# EAGLE design furby_osi (EAGLE 6.3)
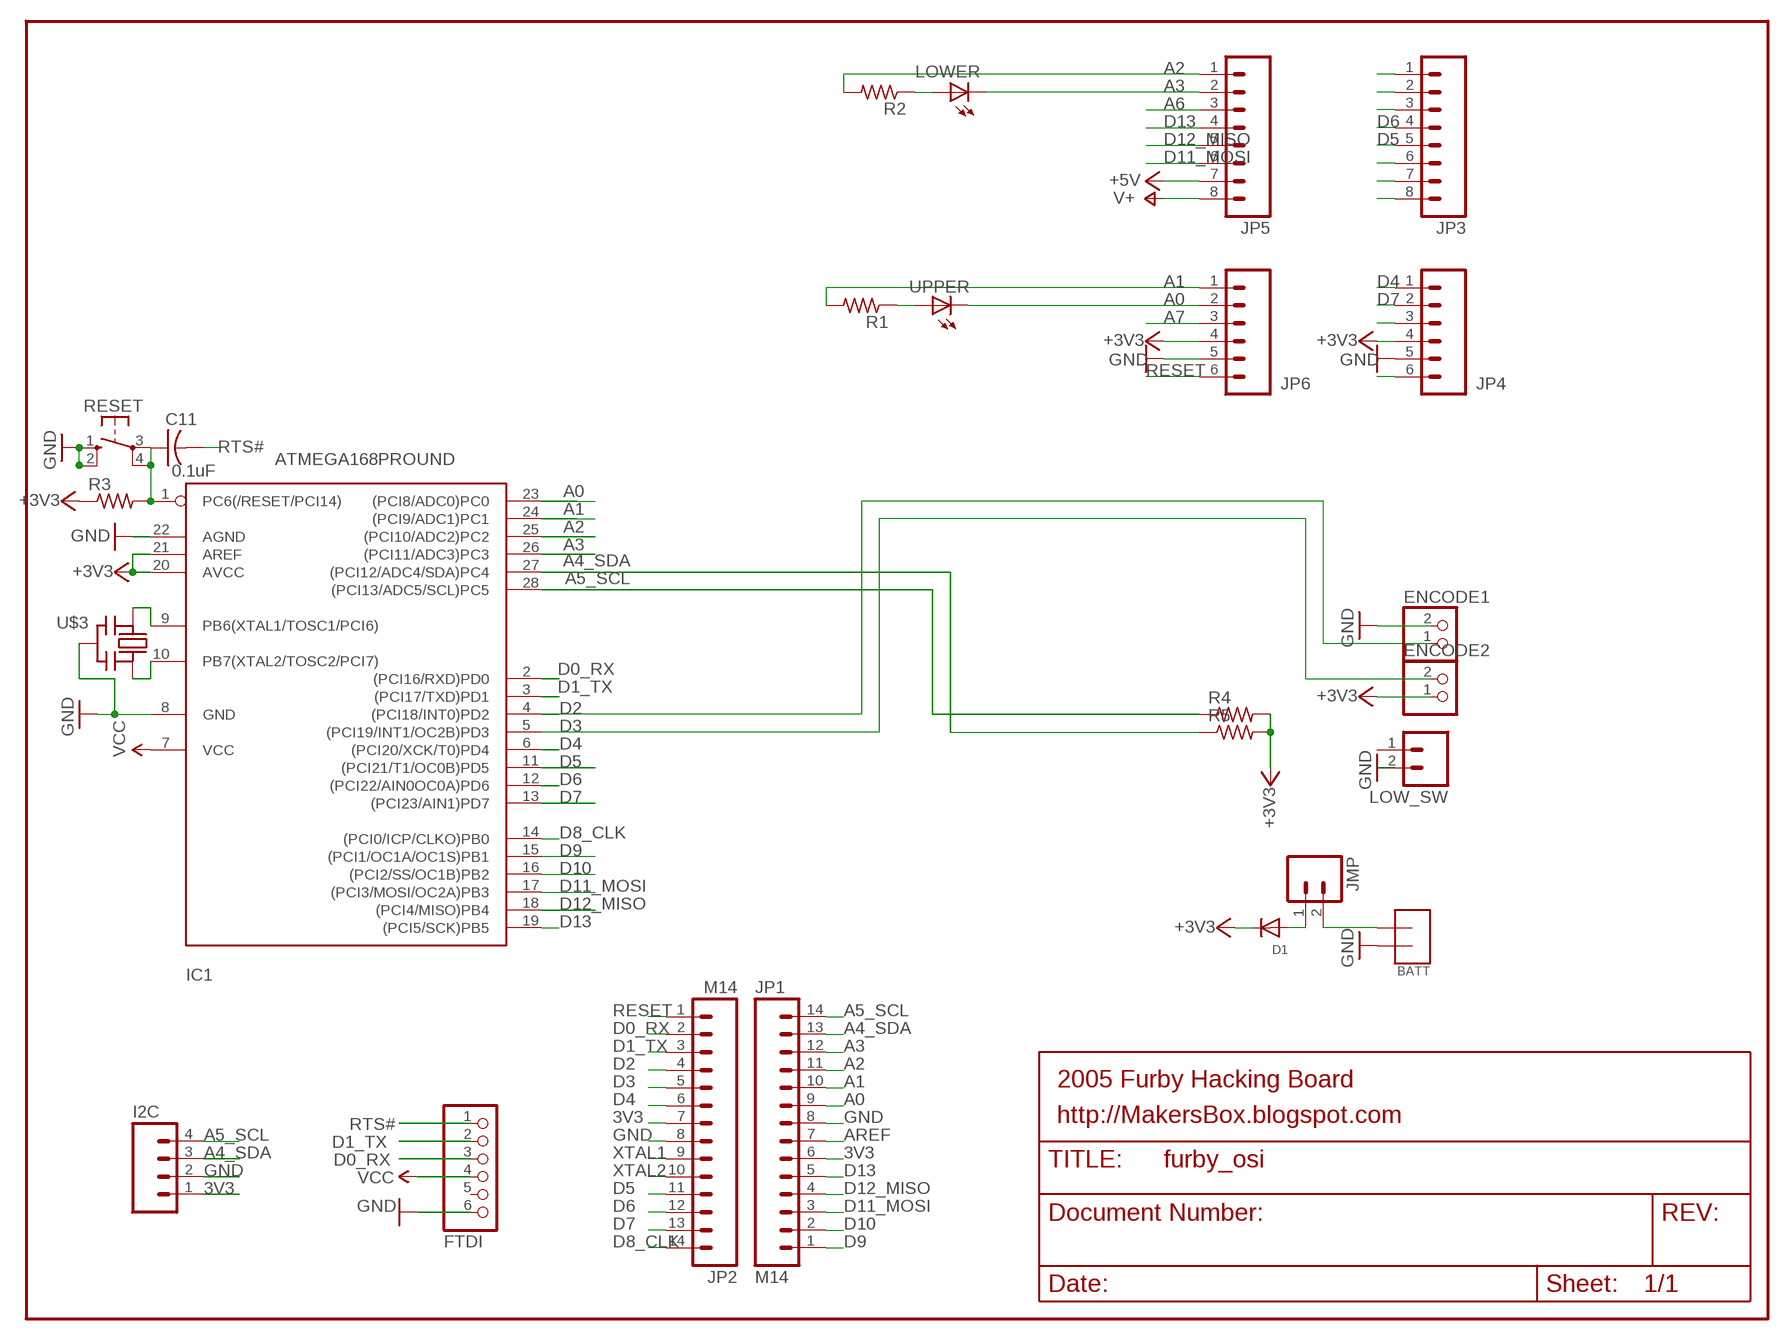
[diagram p0: schematic, sheet 1]

## Parts
BATT  TERMINAL2  [TERMINAL_2]
C11  0.1uF  C-US025-025X050  [C025-025X050]
D1  DIODEDO-1N4148  [DO-1N4148]
ENCODE1  JST_2PIN-THM  [JST-PH-2-THM]
ENCODE2  JST_2PIN-THM  [JST-PH-2-THM]
FTDI  FTDI  PINHD-1X6CB  [1X06-CLEANBIG]
I2C  M04PTH  [1X04]
IC1  ATMEGA168PROUND  [DIL28-3-ROUND]
JMP  M02PTH  [1X02]
JP1  M14  [1X14]
JP2  M14  [1X14]
JP3  M081X08  [1X08]
JP4  M06SIP  [1X06]
JP5  M081X08  [1X08]
JP6  M06SIP  [1X06]
LOW_SW  M02PTH  [1X02]
LOWER  LED3MM  [LED3MM]
R1  R-US_0204/7  [0204/7]
R2  R-US_0204/7  [0204/7]
R3  R-US_0204/7  [0204/7]
R4  R-US_0204/7  [0204/7]
R5  R-US_0204/7  [0204/7]
RESET  10-XX  [B3F-10XX]
U$3  CERMOSCILL-THM  [CERM_OSC]
UPPER  LED3MM  [LED3MM]

## Nets
3V3: D1.C ENCODE2.1 FTDI.4 I2C.1 IC1.7(VCC) IC1.20(AVCC) IC1.21(AREF) JP1.6 JP2.7 JP4.4 JP6.4 R3.1 R4.2 R5.2 ; supply symbol labelled VCC, +3V3
+5V: JP5.7
A0: IC1.23((PCI8/ADC0)PC0) JP1.9 JP6.2 UPPER.K(C)
A1: IC1.24((PCI9/ADC1)PC1) JP1.10 JP6.1 R1.2
A2: IC1.25((PCI10/ADC2)PC2) JP1.11 JP5.1 R2.2
A3: IC1.26((PCI11/ADC3)PC3) JP1.12 JP5.2 LOWER.K(C)
A4_SDA: I2C.3 IC1.27((PCI12/ADC4/SDA)PC4) JP1.13 R5.1
A5_SCL: I2C.4 IC1.28((PCI13/ADC5/SCL)PC5) JP1.14 R4.1
A6: JP5.3
A7: JP6.3
AREF: JP1.7
D0_RX: FTDI.3 IC1.2((PCI16/RXD)PD0) JP2.2
D1_TX: FTDI.2 IC1.3((PCI17/TXD)PD1) JP2.3
D2: ENCODE1.1 IC1.4((PCI18/INT0)PD2) JP2.4
D3: ENCODE2.2 IC1.5((PCI19/INT1/OC2B)PD3) JP2.5
D4: IC1.6((PCI20/XCK/T0)PD4) JP2.6 JP4.1
D5: IC1.11((PCI21/T1/OC0B)PD5) JP2.11 JP3.5
D6: IC1.12((PCI22/AIN0OC0A)PD6) JP2.12 JP3.4
D7: IC1.13((PCI23/AIN1)PD7) JP2.13 JP4.2
D8_CLK: IC1.14((PCI0/ICP/CLKO)PB0) JP2.14
D9: IC1.15((PCI1/OC1A/OC1S)PB1) JP1.1
D10: IC1.16((PCI2/SS/OC1B)PB2) JP1.2
D11_MOSI: IC1.17((PCI3/MOSI/OC2A)PB3) JP1.3 JP5.6
D12_MISO: IC1.18((PCI4/MISO)PB4) JP1.4 JP5.5
D13: IC1.19((PCI5/SCK)PB5) JP1.5 JP5.4
GND [power]: BATT.P$1 ENCODE1.2 FTDI.6 I2C.2 IC1.8(GND) IC1.22(AGND) JP1.8 JP2.8 JP4.5 JP6.5 LOW_SW.2 RESET.1(S) RESET.2(S1) U$3.P$2(GND)
N$1: R1.1 UPPER.A
N$2: LOWER.A R2.1
N$3: BATT.P$2 JMP.2
N$4: D1.A JMP.1
N$5: JP3.2
N$6: JP3.1
N$7: JP3.3
N$10: JP3.6
N$11: JP3.7
N$12: JP3.8
N$15: JP4.3
N$16: JP4.6
RESET: C11.1 IC1.1(PC6(/RESET/PCI14)) JP2.1 JP6.6 R3.2 RESET.3(P) RESET.4(P1)
RTS#: C11.2 FTDI.1
V+: JP5.8
XTAL1: IC1.9(PB6(XTAL1/TOSC1/PCI6)) JP2.9 U$3.P$1(IN)
XTAL2: IC1.10(PB7(XTAL2/TOSC2/PCI7)) JP2.10 U$3.P$3(OUT)
Unconnected: FTDI.5 LOW_SW.1

## Notes on the sheet
- 2005 Furby Hacking Board
- http://MakersBox.blogspot.com

## Library data of the parts
BATT = _my-parts:TERMINAL2
C11 = minimidi:C-US: CAPACITOR, American symbol
D1 = adafruit:DIODE: Diode SMADIODE - SMA Surface Mount Package 20V 1A Schottky Diode Digikey: 641-1014-6-ND DO-1N4148 - Through Hole Small Current Diode SOD-123 20V 1 A (.5mV Vf) Schottky Diode - Digikey: MBRX120TPMSCT-ND SOD-323 10V 570mA (.38mV Vf, 3ns) Schottky Diode - Digikey: ZLLS410CT-ND SOD-523 30V 30mA Schottky Diode (RB751S-40TE61) - Digikey: RB751S-40TE61CT-ND SOT23-R/W - SOT23 Package (R = Solder Paste/Reflow Ovens, W = Hand-Soldering) BAT54Film 40V 300mA - Digikey: 497-7162-1-ND
ENCODE1 ENCODE2 = adafruit_mod:JST_2PIN: JST 2-Pin Connectors of various flavors SMT-RA (S2B-PH-SM4) 4UConnector #17311 SMT (B2B-PH-SM4) THM-RA (S2B-PH) THM (B2B-PH)
FTDI = carduino:PINHD-1X6: PIN HEADER
I2C = SparkFun:M04: Header 4 Standard 4-pin 0.1" header. Use with straight break away headers (SKU : PRT-00116), right angle break away headers (PRT-00553), swiss pins (PRT-00743), machine pins (PRT-00117), and female headers (PRT-00115). Molex polarized connector foot print use with SKU : PRT-08231 with associated crimp pins and housings. 1MM SMD Version SKU: PRT-10208
IC1 = adafruit:ATMEGA168*P: MICROCONTROLLER 16 kBytes FLASH 1 kBytes SRAM 512 Bytes EEPROM USART 8-channel 10 bit ADC
JMP LOW_SW = SparkFun:M02: Header 2 Standard 2-pin 0.1" header. Use with straight break away headers (SKU : PRT-00116), right angle break away headers (PRT-00553), swiss pins (PRT-00743), machine pins (PRT-00117), and female headers (PRT-00115). Molex polarized connector foot print use with SKU : PRT-08233 with associated crimp pins and housings.
JP1 JP2 = SparkFun_mod:M14: Header 14 Standard 14-pin 0.1" header. Use with straight break away headers (SKU : PRT-00116), right angle break away headers (PRT-00553), swiss pins (PRT-00743), machine pins (PRT-00117), and female headers (PRT-00115).
JP3 JP5 = SparkFun_mod:M08: Header 8 Standard 8-pin 0.1" header. Use with straight break away headers (SKU : PRT-00116), right angle break away headers (PRT-00553), swiss pins (PRT-00743), machine pins (PRT-00117), and female headers (PRT-00115).
JP4 JP6 = SparkFun:M06: Header 6 Standard 6-pin 0.1" header. Use with straight break away headers (SKU : PRT-00116), right angle break away headers (PRT-00553), swiss pins (PRT-00743), machine pins (PRT-00117), and female headers (PRT-00115). Molex polarized connector foot print use with SKU : PRT-08094 with associated crimp pins and housings. NOTES ON THE VARIANTS LOCK and LOCK_LONGPADS... This footprint was designed to help hold the alignment of a through-hole component (i.e. 6-pin header) while soldering it into place. You may notice that each hole has been shifted either up or down by 0.005 of an inch from it's more standard position (which is a perfectly straight line). This slight alteration caused the pins (the squares in the middle) to touch the edges of the holes. Because they are alternating, it causes a "brace" to hold the component in place. 0.005 has proven to be the perfect amount of "off-center" position when using our standard breakaway headers. Although looks a little odd when you look at the bare footprint, once you have a header in there, the alteration is very hard to notice. Also, if you push a header all the way into place, it is covered up entirely on the bottom side. This idea of altering the position of holes to aid alignment will be further integrated into the Sparkfun Library for other footprints. It can help hold any component with 3 or more connection pins.
LOWER UPPER = minimidi:LED: LED OSRAM: - CHIPLED LG R971, LG N971, LY N971, LG Q971, LY Q971, LO R971, LY R971 LH N974, LH R974 LS Q976, LO Q976, LY Q976 LO Q996 - Hyper CHIPLED LW Q18S LB Q993, LB Q99A, LB R99A - SideLED LS A670, LO A670, LY A670, LG A670, LP A670 LB A673, LV A673, LT A673, LW A673 LH A674 LY A675 LS A676, LA A676, LO A676, LY A676, LW A676 LS A679, LY A679, LG A679 - Hyper Micro SIDELED® LS Y876, LA Y876, LO Y876, LY Y876 LT Y87S - SmartLED LW L88C, LW L88S LB L89C, LB L89S, LG L890 LS L89K, LO L89K, LY L89K LS L896, LA L896, LO L896, LY L896 - TOPLED LS T670, LO T670, LY T670, LG T670, LP T670 LSG T670, LSP T670, LSY T670, LOP T670, LYG T670 LG T671, LOG T671, LSG T671 LB T673, LV T673, LT T673, LW T673 LH T674 LS T676, LA T676, LO T676, LY T676, LB T676, LH T676, LSB T676, LW T676 LB T67C, LV T67C, LT T67C, LS T67K, LO T67K, LY T67K, LW E67C LS E67B, LA E67B, LO E67B, LY E67B, LB E67C, LV E67C, LT E67C LW T67C LS T679, LY T679, LG T679 LS T770, LO T770, LY T770, LG T770, LP T770 LB T773, LV T773, LT T773, LW T773 LH T774 LS E675, LA E675, LY E675, LS T675 LS T776, LA T776, LO T776, LY T776, LB T776 LHGB T686 LT T68C, LB T68C - Hyper Mini TOPLED® LB M676 - Mini TOPLED Santana® LG M470 LS M47K, LO M47K, LY M47K Source: http://www.osram.convergy.de/
R1-R5 = adafruit:R-US_: RESISTOR, American symbol
RESET = switch-omron:10-XX: OMRON SWITCH
U$3 = adafruit:CERMOSCILL: Ceramic oscillator with built in capacitors such as ZTT-12MHz http://www.ladyada.net/library/eagle

## Net classes
1 power: width 0.61 mm

## Board
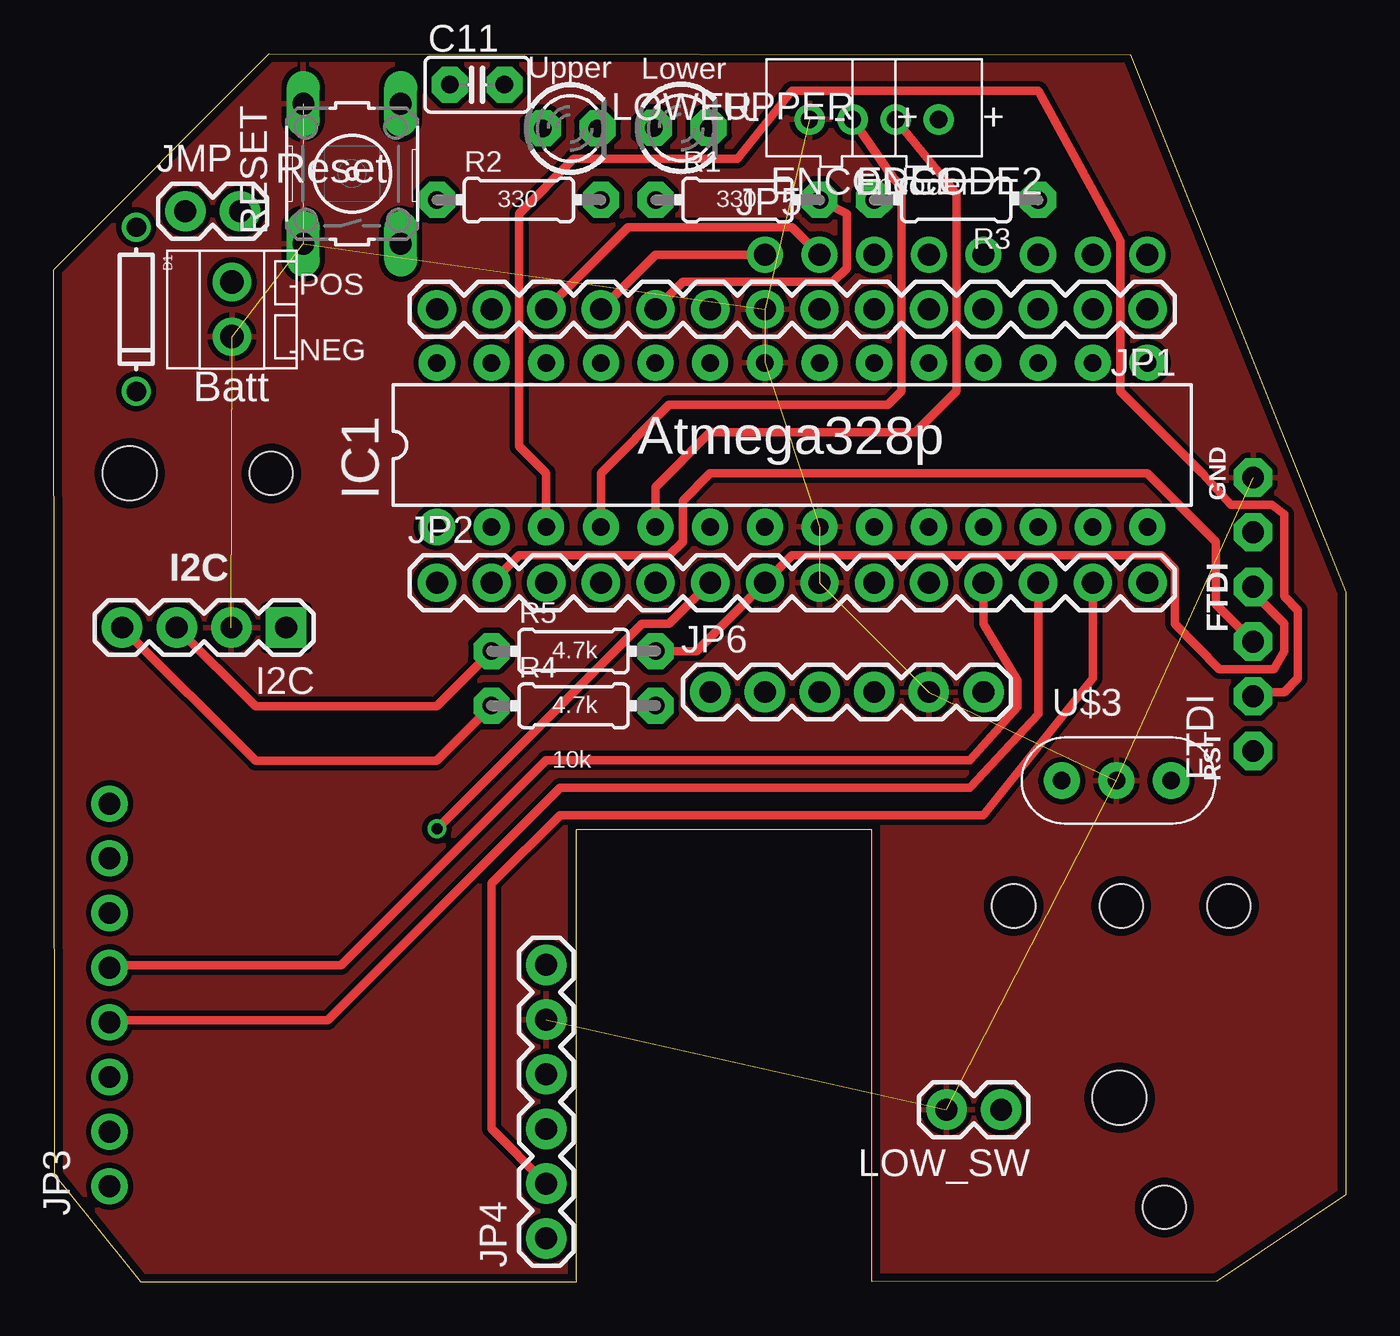
[diagram p1: board, top side]
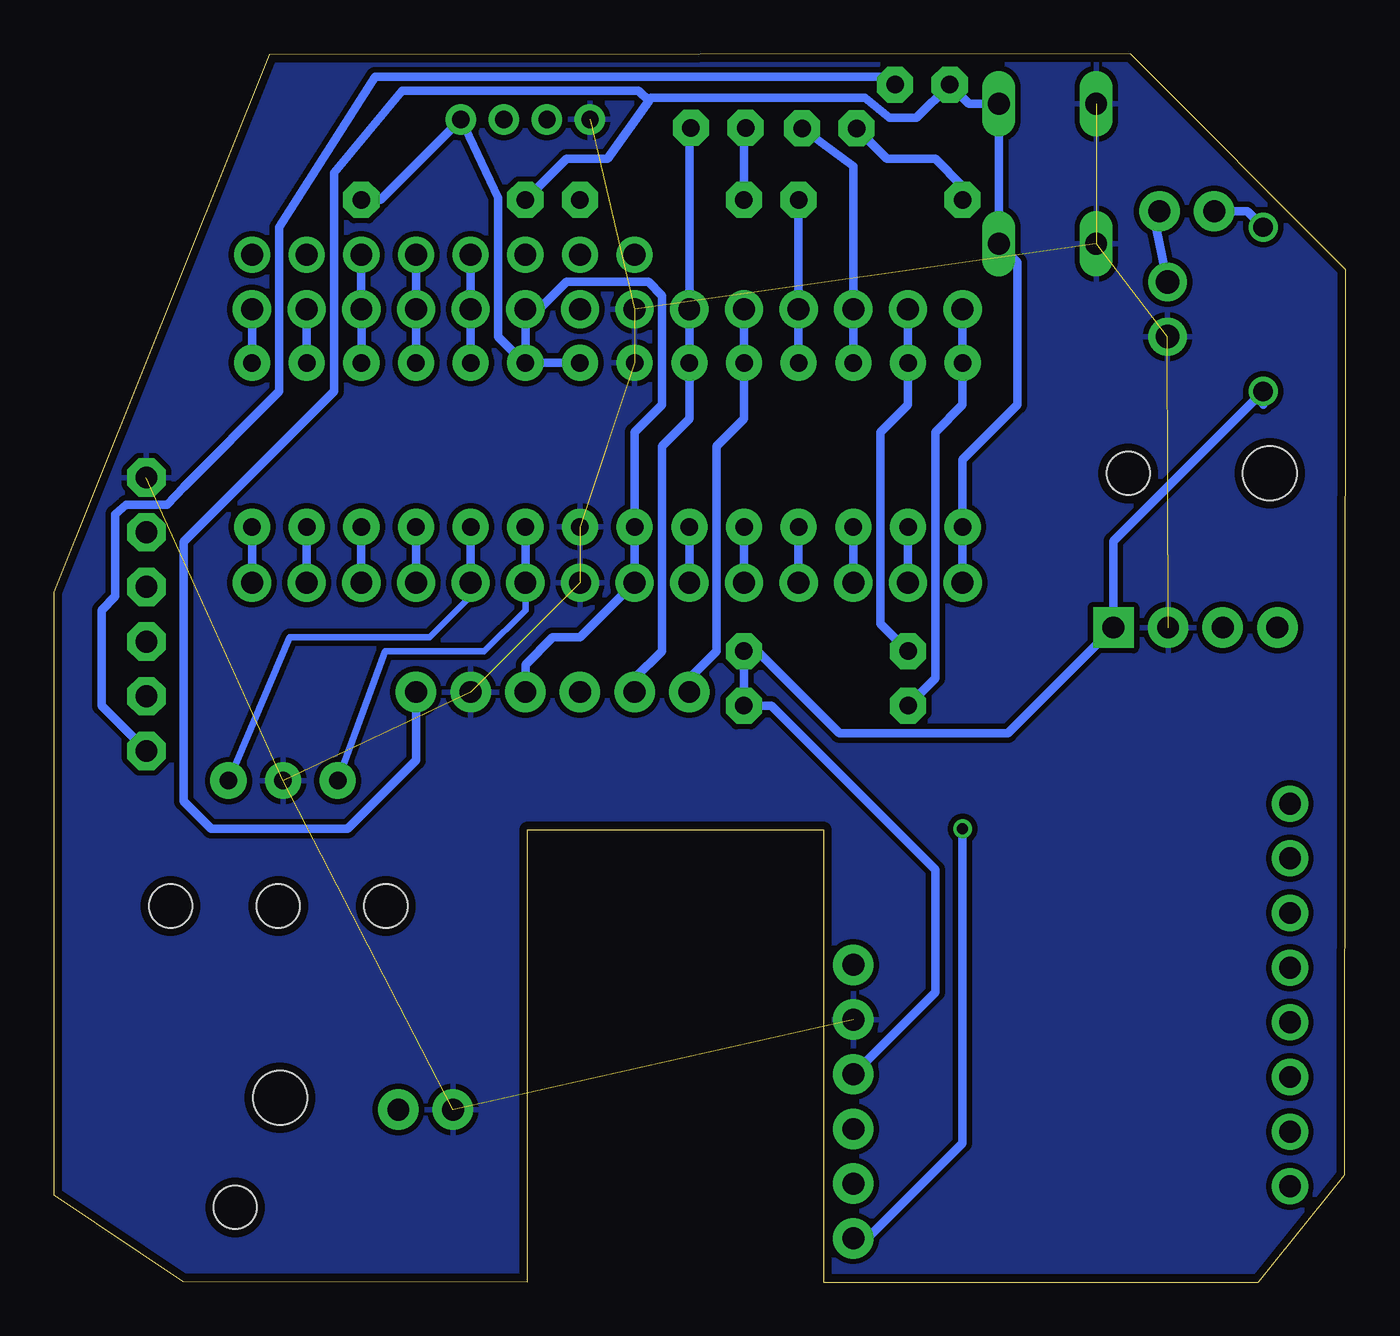
[diagram p2: board, bottom side, seen from below]

Size 60.03 x 57.06 mm. Coordinates in mm from the lower left corner, seen from the top.
Outline: 10.01,57.06 0,47.03 0.05,4.98 4.05,0 24.26,0 24.27,21.01 38.02,21.01 38.02,0.01 54.03,0.05 60.03,4.05 60.03,32.04 50.03,57.01 10,57.05
Copper layers (1*16): Top 0.0356mm / dielectric 1.5011mm / Bottom 0.0356mm
Design rules "LaenPCBOrder": minimum track width 6mil, minimum drill 13mil, track to track 6mil, track to pad 6mil, pad to pad 6mil, via to via 6mil, smd to smd 6mil, copper to edge 15mil, drill to drill 6mil, minimum pad ring 7mil, minimum via ring 7mil, stop-mask expansion 4mil, vias tented up to drill 0mil, thermal gap 10mil
Holes 3.2 mm at 45.44,63.09 40.12,62.42
Holes 2 mm at 10.11,37.57 51.61,3.47 49.61,17.47 54.61,17.47 44.61,17.47
Holes 2.5 mm at 3.52,37.57 49.52,8.57

### Footprints (pad centres in the part's own frame; a part is rotated, then mirrored left to right if it is on the bottom)
TERMINAL_2 = drill 1.1 pad 1.778: P$1 1.27,0; P$2 -1.27,0
C025-025X050 = drill 0.813 pad 1.676 octagon: 1 -1.27,0; 2 1.27,0
DO-1N4148 = drill 0.9: A -3.81,0; C 3.81,0
JST-PH-2-THM = drill 0.8 pad 1.422: 1 1,0; 2 -1,0
1X06-CLEANBIG = drill 1.016 pad 1.778 octagon: 1 -6.35,0; 2 -3.81,0; 3 -1.27,0; 4 1.27,0; 5 3.81,0; 6 6.35,0
1X04 = drill 1.016 pad 1.88 square: 1 0,0 | drill 1.016 pad 1.88: 2 2.54,0; 3 5.08,0; 4 7.62,0
DIL28-3-ROUND = drill 0.813 pad 1.676: 1 -16.51,-3.81; 2 -13.97,-3.81; 3 -11.43,-3.81; 4 -8.89,-3.81; 5 -6.35,-3.81; 6 -3.81,-3.81; 7 -1.27,-3.81; 8 1.27,-3.81; 9 3.81,-3.81; 10 6.35,-3.81; 11 8.89,-3.81; 12 11.43,-3.81; 13 13.97,-3.81; 14 16.51,-3.81; 15 16.51,3.81; 16 13.97,3.81; 17 11.43,3.81; 18 8.89,3.81; 19 6.35,3.81; 20 3.81,3.81; 21 1.27,3.81; 22 -1.27,3.81; 23 -3.81,3.81; 24 -6.35,3.81; 25 -8.89,3.81; 26 -11.43,3.81; 27 -13.97,3.81; 28 -16.51,3.81
1X02 = drill 1.016 pad 1.88: 1 0,0; 2 2.54,0
1X14 = drill 1.016 pad 1.778: 1 0,0; 2 2.54,0; 3 5.08,0; 4 7.62,0; 5 10.16,0; 6 12.7,0; 7 15.24,0; 8 17.78,0; 9 20.32,0; 10 22.86,0; 11 25.4,0; 12 27.94,0; 13 30.48,0; 14 33.02,0
1X08 = drill 1.016 pad 1.676: 1 0,0; 2 2.54,0; 3 5.08,0; 4 7.62,0; 5 10.16,0; 6 12.7,0; 7 15.24,0; 8 17.78,0
1X06 = drill 1.016 pad 1.88: 1 0,0; 2 2.54,0; 3 5.08,0; 4 7.62,0; 5 10.16,0; 6 12.7,0
LED3MM = drill 0.813 pad 1.676 octagon: A -1.27,0; K 1.27,0
0204/7 = drill 0.813 pad 1.676 octagon: 1 -3.81,0; 2 3.81,0
B3F-10XX = drill 1.016 long: 1 -3.251,2.261; 2 3.251,2.261; 3 -3.251,-2.261; 4 3.251,-2.261
CERM_OSC = drill 0.813 pad 1.676: P$1 -2.54,0; P$2 0,0; P$3 2.54,0

### Placement (x,y rotation side)
BATT  8.28,45.19 270 top
C11  19.67,55.62 0 top
D1  3.83,45.19 270 top
ENCODE1  36.12,54.01 0 top
ENCODE2  40.12,54.01 0 top
FTDI  55.73,31.02 90 top
I2C  10.79,30.41 180 top
IC1  34.31,38.89 0 top
JMP  6.11,49.74 0 top
JP1  50.82,45.19 180 top
JP2  17.8,32.49 0 top
JP3  2.59,4.45 90 top
JP4  22.88,2.04 90 top
JP5  33.04,47.73 0 top
JP6  30.5,27.41 0 top
LOW_SW  44.02,8.01 180 top
LOWER  24,53.59 0 top
R1  31.77,50.27 0 top
R2  21.61,50.27 0 top
R3  41.93,50.27 180 top
R4  24.15,26.77 0 top
R5  24.15,29.31 0 top
RESET  13.86,51.49 90 top
U$3  49.38,23.3 0 top
UPPER  29.16,53.62 0 top

### Tracks (layer width: path | path; a pad name or v marks a point on that pad's centre or on a via)
3V3
  Top 0.406: FTDI.4 55.73,32.03 57.17,30.59 57.17,29.31 56.69,28.48 54.15,28.48 52.09,30.59 52.09,33.12 51.46,33.76 34.31,33.76 JP2.7 29.87,29.31 R5.2
  Bottom 0.406: JP6.4 38.12,28.68 36.85,29.95 35.58,29.95 JP2.7 IC1.7 33.04,39.48 31.77,40.74 31.77,45.82 32.41,46.46 36.22,46.46 37.49,45.19 JP1.6 IC1.20 | IC1.21 IC1.20 | IC1.20 38.17,42.7 39.39,43.92 39.39,50.38 ENCODE2.1 44.86,50.27 R3.1 | 3.83,40.74 D1.C 10.79,34.42 I2C.1 15.7,25.51 23.52,25.51 27.33,29.31 R5.2 R4.2 26.69,26.77 19.07,19.16 19.07,13.46 JP4.4
A0
  Bottom 0.406: UPPER.K 30.5,53.54 JP1.9 IC1.23 30.5,40.11 31.77,38.84 31.77,29.31 33.04,28.05 JP6.2
A1
  Top 0.406: JP1.10 29.23,46.46 36.22,46.46 36.85,47.09 36.85,49.63 R1.2
  Bottom 0.406: JP1.10 IC1.24 27.96,40.11 29.23,38.84 29.23,29.31 30.5,28.05 JP6.1
A2
  Top 0.406: JP1.11 27.96,47.73 JP5.1
  Bottom 0.406: IC1.25 JP1.11 R2.2
A3
  Top 0.406: JP1.12 26.69,49 34.31,49 JP5.2
  Bottom 0.406: IC1.26 JP1.12 22.88,51.84 LOWER.K
A4_SDA
  Top 0.406: R5.1 17.78,26.75 9.37,26.75 I2C.3
  Bottom 0.406: JP1.13 IC1.27 20.34,40.74 21.61,39.48 21.61,30.59 R5.1
A5_SCL
  Top 0.406: R4.1 17.78,24.21 9.37,24.21 I2C.4
  Bottom 0.406: JP1.14 IC1.28 | IC1.28 | IC1.28 17.8,40.74 19.07,39.48 19.07,28.05 R4.1
D0_RX
  Top 0.406: JP2.2 21.61,33.76 28.6,33.76 29.23,34.39 29.23,36.3 30.5,37.57 50.82,37.57 54,34.39 54,31.48 FTDI.3
  Bottom 0.406: IC1.2 JP2.2
D1_TX
  Top 0.406: IC1.3 22.88,37.57 21.61,38.84 21.61,49.63 24.15,52.17 31.77,52.17 34.31,55.35 45.74,55.35 49.55,48.36 49.55,41.38 53.36,37.57 54.68,36.12 56.59,36.12 57.17,35.66 57.17,31.85 57.81,31.22 57.81,28.05 57.17,27.41 55.93,27.41 FTDI.2
  Bottom 0.406: JP2.3 IC1.3
D2
  Top 0.406: ENCODE1.1 39.02,51.27 39.39,50.91 39.39,41.38 38.76,40.74 28.6,40.74 25.42,37.57 IC1.4
  Bottom 0.406: JP2.4 IC1.4
D3
  Top 0.406: IC1.5 27.96,36.93 30.5,39.48 40.03,39.48 41.93,41.38 41.93,50.56 ENCODE2.2
  Bottom 0.406: JP2.5 IC1.5
D4  (via drill 0.51)
  Top 0.406: JP2.6 28.6,30.59 27.33,30.59 v17.8,21.06
  Bottom 0.406: JP2.6 IC1.6 | JP4.1 22.22,2.03 17.8,6.46 v17.8,21.06
D5
  Top 0.406: JP2.11 43.2,30.59 44.78,27.97 44.78,26.7 42.57,24.23 22.88,24.23 13.36,14.71 2.69,14.71 JP3.5
  Bottom 0.406: JP2.11 IC1.11
D6
  Top 0.406: JP2.12 45.74,26.37 42.57,22.96 23.52,22.96 12.72,12.17 2.69,12.17 JP3.4
  Bottom 0.406: JP2.12 45.74,35.03 IC1.12
D7
  Top 0.406: JP2.13 48.28,28.05 43.2,21.7 23.52,21.7 20.34,18.52 20.34,7.12 JP4.2
  Bottom 0.406: JP2.13 IC1.13
D8_CLK
  Bottom 0.406: JP2.14 IC1.14
D9
  Bottom 0.406: IC1.15 JP1.1
D10
  Bottom 0.406: IC1.16 JP1.2
D11_MOSI
  Bottom 0.406: IC1.17 JP1.3 JP5.6
D12_MISO
  Bottom 0.406: IC1.18 JP1.4 JP5.5
D13
  Bottom 0.406: IC1.19 JP1.5 JP5.4
GND  (13 unrouted)
  pour Bottom (isolate 0.254): -4.2,59.25 68.6,59.26 67.49,-1.96 -5.13,-2.19
  pour Top (isolate 0.254): -3.14,60.35 68.58,59.22 68.26,-3.05 -3.19,-2.19
N$1
  Bottom 0.406: R1.1 27.96,53.54 UPPER.A
N$2
  Bottom 0.406: 22.58,54.08 LOWER.A 21.31,52.17 19.07,52.17 17.8,50.91 R2.1
N$3
  Bottom 0.406: BATT.P$2 8.91,49.48 JMP.2
N$4
  Bottom 0.406: JMP.1 4.58,49.74 D1.A
RESET
  Bottom 0.406: JP2.1 IC1.1 17.8,38.21 15.26,40.74 15.26,47.38 RESET.3 RESET.4 17.52,54.74 C11.1 19.94,54.08 21.21,54.08 22.35,55.02 32.28,55.02 32.38,54.88 | R3.2 36.22,52.17 34.31,52.17 32.38,54.88 | JP6.6 43.2,24.23 46.38,21.06 52.73,21.06 54,22.33 54,34.39 47.01,41.38 47.01,51.54 43.84,55.35 32.85,55.35 32.38,54.88
RTS#
  Bottom 0.406: FTDI.1 55.73,24.7 57.81,26.77 57.81,31.22 57.17,31.85 57.17,35.66 56.67,36.12 54.76,36.12 54,36.93 49.55,41.38 49.55,49 45.11,55.98 21.3,55.98 C11.2
XTAL1
  Bottom 0.305: JP2.9 38.12,31.22 40.03,29.31 44.63,29.31 U$3.P$1
  Bottom 0.406: JP2.9 IC1.9
XTAL2
  Bottom 0.305: JP2.10 40.66,31.85 42.57,29.95 49.08,29.95 U$3.P$3
  Bottom 0.406: JP2.10 IC1.10

### Text on the board
tPlace: Upper | Lower | Reset | 330 | 330 | Encoder | Reset | -POS / / -NEG | Batt | GND | Atmega328p | I2C | FTDI | 4.7k | 4.7k | RST | 10k
bDocu: Open Source / Hardware | i2c_motor_v2 Jan 2012 / Dawson-Station.blogspot.com / 648.ken@gmail.com